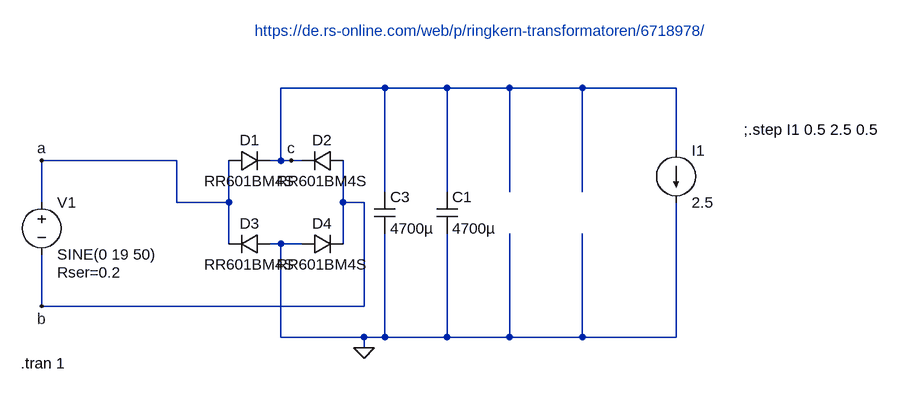
[diagram p0: schematic trafo.asc]
trafo.asc, the LTspice schematic file:
Version 4
SHEET 1 1480 680
WIRE 624 -48 464 -48
WIRE 720 -48 624 -48
WIRE 816 -48 720 -48
WIRE 928 -48 816 -48
WIRE 1072 -48 928 -48
WIRE 1072 48 1072 -48
WIRE 304 64 96 64
WIRE 464 64 464 -48
WIRE 464 64 448 64
WIRE 480 64 464 64
WIRE 496 64 480 64
WIRE 624 112 624 -48
WIRE 720 112 720 -48
WIRE 816 112 816 -48
WIRE 928 112 928 -48
WIRE 96 128 96 64
WIRE 304 128 304 64
WIRE 384 128 384 64
WIRE 384 128 304 128
WIRE 560 128 560 64
WIRE 592 128 560 128
WIRE 384 192 384 128
WIRE 464 192 448 192
WIRE 496 192 464 192
WIRE 560 192 560 128
WIRE 96 288 96 208
WIRE 592 288 592 128
WIRE 592 288 96 288
WIRE 464 336 464 192
WIRE 592 336 464 336
WIRE 624 336 624 176
WIRE 624 336 592 336
WIRE 720 336 720 176
WIRE 720 336 624 336
WIRE 816 336 816 176
WIRE 816 336 720 336
WIRE 928 336 928 176
WIRE 928 336 816 336
WIRE 1072 336 1072 128
WIRE 1072 336 928 336
WIRE 592 352 592 336
FLAG 592 352 0
FLAG 96 64 a
FLAG 96 288 b
FLAG 480 64 c
SYMBOL voltage 96 112 R0
WINDOW 123 0 0 Left 0
WINDOW 39 24 124 Left 2
SYMATTR SpiceLine Rser=0.2
SYMATTR InstName V1
SYMATTR Value SINE(0 19 50)
SYMBOL diode 384 80 R270
WINDOW 0 32 32 VTop 2
WINDOW 3 0 32 VBottom 2
SYMATTR InstName D1
SYMATTR Value RR601BM4S
SYMBOL current 1072 48 R0
WINDOW 123 0 0 Left 0
WINDOW 39 0 0 Left 0
SYMATTR InstName I1
SYMATTR Value 2.5
SYMBOL cap 608 112 R0
SYMATTR InstName C3
SYMATTR Value 4700µ
SYMATTR SpiceLine Rser=0.124
SYMBOL diode 560 48 R90
WINDOW 0 0 32 VBottom 2
WINDOW 3 32 32 VTop 2
SYMATTR InstName D2
SYMATTR Value RR601BM4S
SYMBOL diode 448 176 R90
WINDOW 0 0 32 VBottom 2
WINDOW 3 32 32 VTop 2
SYMATTR InstName D3
SYMATTR Value RR601BM4S
SYMBOL diode 496 208 R270
WINDOW 0 32 32 VTop 2
WINDOW 3 0 32 VBottom 2
SYMATTR InstName D4
SYMATTR Value RR601BM4S
SYMBOL cap 704 112 R0
SYMATTR InstName C1
SYMATTR Value 4700µ
SYMATTR SpiceLine Rser=0.124
TEXT 64 376 Left 2 !.tran 1
TEXT 424 -136 Left 2 ;https://de.rs-online.com/web/p/ringkern-transformatoren/6718978/
TEXT 1176 16 Left 2 !;.step I1 0.5 2.5 0.5

The netlist it stands for:
* trafo.asc
V1 a b SINE(0 19 50) Rser=0.2
D1 a c RR601BM4S
I1 c 0 2.5
C3 c 0 4700µ Rser=0.124
D2 b c RR601BM4S
D3 0 a RR601BM4S
D4 0 b RR601BM4S
C1 c 0 4700µ Rser=0.124
.model D D
.lib standard.dio
.tran 1
* https://de.rs-online.com/web/p/ringkern-transformatoren/6718978/
;.step I1 0.5 2.5 0.5
.backanno
.end

* Results of the author's LTspice run, read from the files saved beside the schematic
* Operating Point, zero values left out:
*   V(a) = -841.5 mV
*   V(b) = -841.5 mV
*   V(c) = -1.683 V
*   I(D4) = 1.25 A
*   I(D3) = 1.25 A
*   I(D2) = 1.25 A
*   I(D1) = 1.25 A
*   I(I1) = 2.5 A